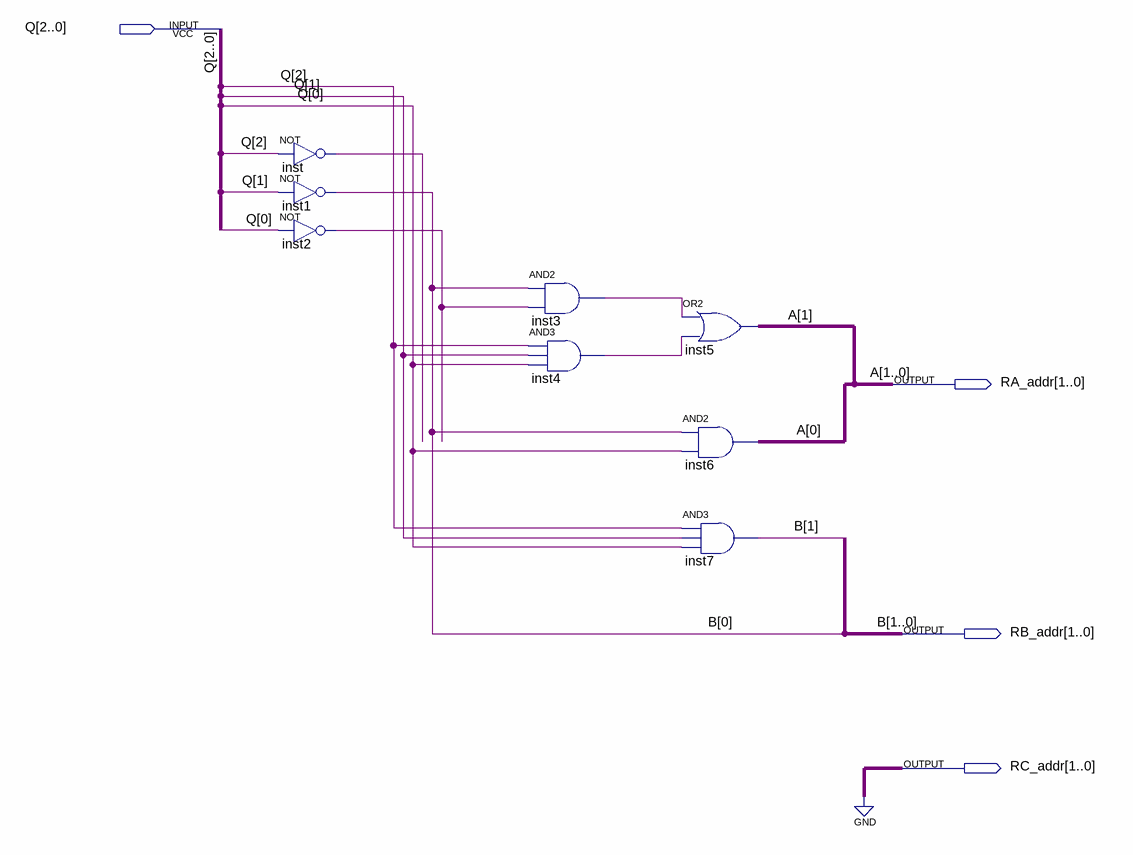
[diagram p0: schematic sheet]
// Quartus schematic RA_RB_RC.bdf as structural Verilog: 8 symbols, 4 pins
module RA_RB_RC (
  input  [2:0] Q,
  output [1:0] RA_addr,
  output [1:0] RB_addr,
  output [1:0] RC_addr
);

  wire inst2_out, inst3_out, inst4_out, inst_out;

  not inst (inst_out, Q[2]);
  not inst1 (RB_addr[0], Q[1]);
  not inst2 (inst2_out, Q[0]);
  and inst3 (inst3_out, RB_addr[0], inst2_out);
  and inst4 (inst4_out, Q[2], Q[1], Q[0]);
  or inst5 (RA_addr[1], inst3_out, inst4_out);
  and inst6 (RA_addr[0], RB_addr[0], Q[0]);
  and inst7 (RB_addr[1], Q[2], Q[1], Q[0]);

  assign RC_addr = 2'b00;

  // Other names for the same wires on the sheet: A[1:0] = RA_addr; B[1:0] = RB_addr
endmodule
